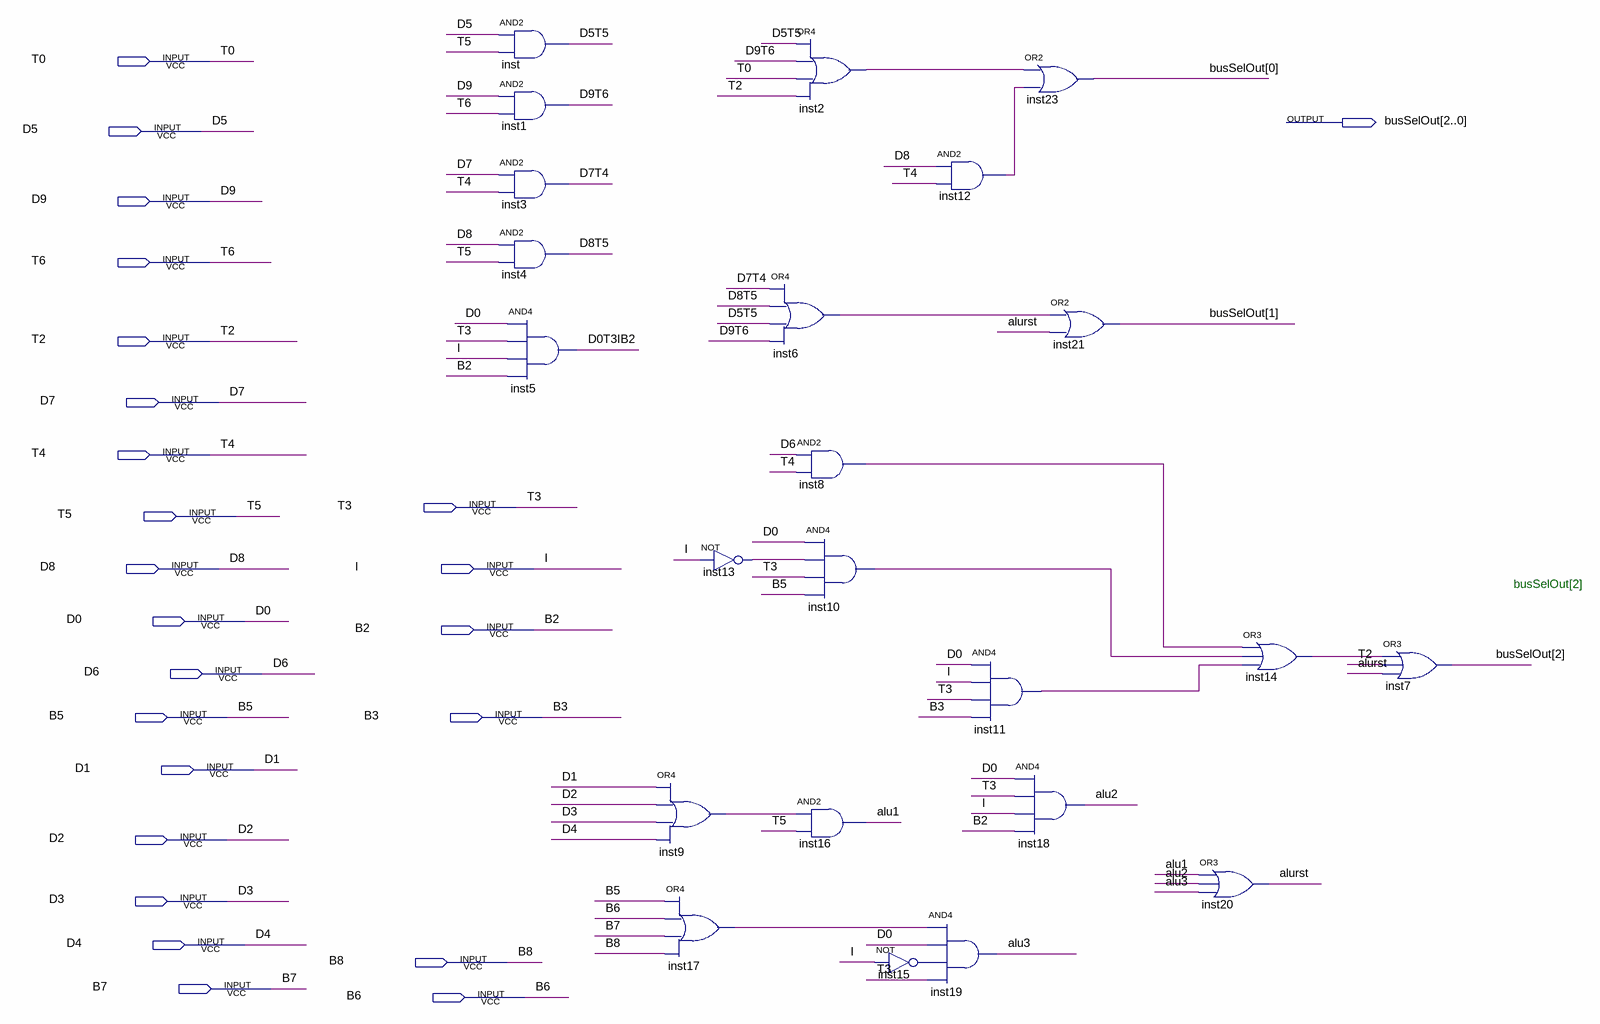
[diagram p0: schematic sheet]
// Quartus schematic busSel.bdf as structural Verilog: 23 symbols, 24 pins
module busSel (
  input  T0,
  input  D5,
  input  D9,
  input  T6,
  input  T2,
  input  D7,
  input  T4,
  input  T3,
  input  T5,
  input  D8,
  input  I,
  input  D0,
  input  B2,
  input  D6,
  input  B5,
  input  B3,
  input  D1,
  input  D2,
  input  D3,
  input  D4,
  input  B8,
  input  B7,
  input  B6,
  output [2:0] busSelOut
);

  wire alu1, alu2, alu3, alurst, D0T3IB2, D5T5, D7T4, D8T5, D9T6, inst2_out, inst6_out, inst8_out, inst9_out,
       inst10_out, inst11_out, inst12_out, inst13_out, inst14_out, inst15_out, inst17_out;

  and inst (D5T5, D5, T5);
  and inst1 (D9T6, D9, T6);
  and inst3 (D7T4, D7, T4);
  and inst4 (D8T5, D8, T5);
  and inst5 (D0T3IB2, D0, T3, I, B2);
  or inst9 (inst9_out, D1, D2, D3, D4);
  or inst17 (inst17_out, B5, B6, B7, B8);
  not inst13 (inst13_out, I);
  or inst2 (inst2_out, D5T5, D9T6, T0, T2);
  or inst6 (inst6_out, D7T4, D8T5, D5T5, D9T6);
  and inst8 (inst8_out, D6, T4);
  and inst10 (inst10_out, D0, inst13_out, T3, B5);
  and inst16 (alu1, inst9_out, T5);
  not inst15 (inst15_out, I);
  and inst12 (inst12_out, D8, T4);
  and inst11 (inst11_out, D0, I, T3, B3);
  and inst19 (alu3, inst17_out, D0, inst15_out, T3);
  or inst23 (busSelOut[0], inst2_out, inst12_out);
  and inst18 (alu2, D0, T3, I, B2);
  or inst21 (busSelOut[1], inst6_out, alurst);
  or inst14 (inst14_out, inst8_out, inst10_out, inst11_out);
  or inst20 (alurst, alu1, alu2, alu3);
  or inst7 (busSelOut[2], inst14_out, T2, alurst);

  // Notes on the sheet:
  //   busSelOut[2]
endmodule
